# Altium schematic sheet TopSheet.SchDoc
size A4
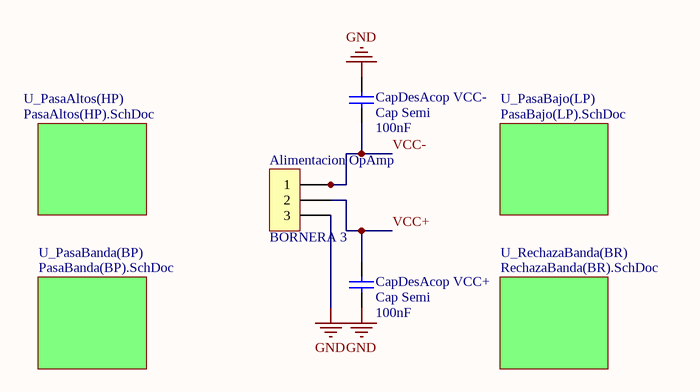
[diagram p0: TopSheet.SchDoc]

## Parts
Alimentacion_OpAmp  BORNERA 3  [BORNERA3]
CapDesAcop_VCC+  Cap Semi  value 100nF  [C0805]
CapDesAcop_VCC-  Cap Semi  value 100nF  [C0805]

## Sub-sheets
U_PasaAltos(HP) = PasaAltos(HP).SchDoc: no entries
U_PasaBajo(LP) = PasaBajo(LP).SchDoc: no entries
U_PasaBanda(BP) = PasaBanda(BP).SchDoc: no entries
U_RechazaBanda(BR) = RechazaBanda(BR).SchDoc: no entries

## Nets
GND: Alimentacion_OpAmp.3 CapDesAcop_VCC+.1 CapDesAcop_VCC-.1
VCC+: Alimentacion_OpAmp.2 CapDesAcop_VCC+.2
VCC-: Alimentacion_OpAmp.1 CapDesAcop_VCC-.2

## Library data of the parts
CapDesAcop_VCC+ CapDesAcop_VCC- = Cap Semi: Capacitor (Semiconductor SIM Model); Published: 8-Jun-2000; LatestRevisionDate: 29-May-2009; LatestRevisionNote: IPC-7351 Footprint Added.; PackageReference: C1206; Publisher: Altium Limited; PackageDescription: Chip Capacitor